# EAGLE design THAT340 (EAGLE 8.1.1)
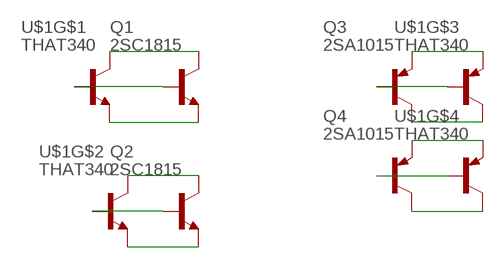
[diagram p0: schematic, sheet 1]

## Parts
Q1  2SC1815  [TO92-BCE]
Q2  2SC1815  [TO92-BCE]
Q3  2SA1015  [TO92-BCE]
Q4  2SA1015  [TO92-BCE]
U$1  THAT340  [DIP254P762X510-14]

## Nets
N$1: Q1.C U$1.1(C)
N$2: Q1.B U$1.2(B)
N$3: Q1.E U$1.3(E)
N$4: Q2.C U$1.14(C)
N$5: Q2.B U$1.13(B)
N$6: Q2.E U$1.12(E)
N$7: Q4.E U$1.10(E)
N$8: Q3.C U$1.7(C)
N$9: Q3.B U$1.6(B)
N$10: Q3.E U$1.5(E)
N$11: Q4.B U$1.9(B)
N$12: Q4.C U$1.8(C)

## Library data of the parts
Q1 Q2 = tranzistory NPN:2SC1815: NPN Transistor
Q3 Q4 = tranzistory PNP:2SA1015: PNP Transistor
U$1 = transistor-arrays:THAT340

## Board
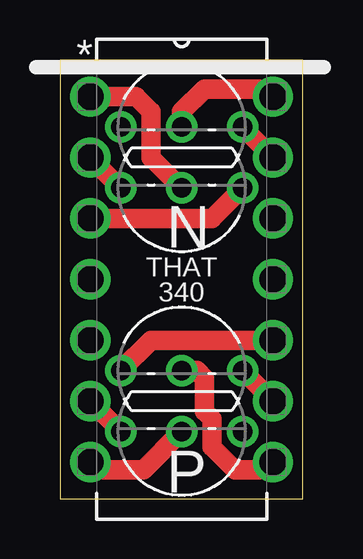
[diagram p1: board, top side]
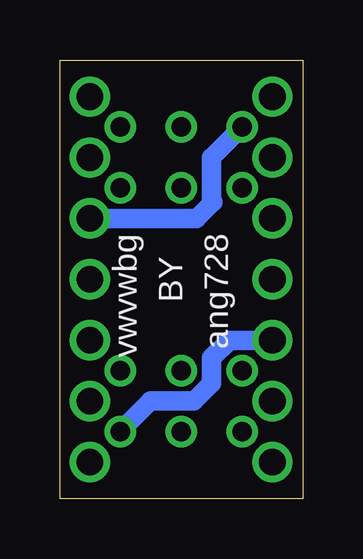
[diagram p2: board, bottom side, seen from below]

Size 10.14 x 18.31 mm. Coordinates in mm from the lower left corner, seen from the top.
Outline: 0,0 10.14,0 10.14,18.31 0,18.31 0,0
Copper layers (1*16): Top 0.035mm / dielectric 1.5mm / Bottom 0.035mm
Design rules "default *": minimum track width 10mil, minimum drill 24mil, track to track 8mil, track to pad 8mil, pad to pad 8mil, via to via 8mil, smd to smd 8mil, copper to edge 8mil, drill to drill 8mil, minimum pad ring 10mil, minimum via ring 8mil, stop-mask expansion 4mil, vias tented up to drill 0mil, thermal gap 10mil

### Footprints (pad centres in the part's own frame; a part is rotated, then mirrored left to right if it is on the bottom)
TO92-BCE = drill 0.813: B 2.54,0; C 0,0; E -2.54,0
DIP254P762X510-14 = drill 1.118: 1 -7.62,15.24; 2 -7.62,12.7; 3 -7.62,10.16; 4 -7.62,7.62; 5 -7.62,5.08; 6 -7.62,2.54; 7 -7.62,0; 8 0,0; 9 0,2.54; 10 0,5.08; 11 0,7.62; 12 0,10.16; 13 0,12.7; 14 0,15.24

### Placement (x,y rotation side)
Q1  5.08,12.97 180 top
Q2  5.08,15.51 0 top
Q3  5.08,2.81 180 top
Q4  5.08,5.35 0 top
U$1  8.89,1.54 0 top

### Tracks (layer width: path | path; a pad name or v marks a point on that pad's centre or on a via)
N$1
  Top 0.813: U$1.1 3.17,16.78 3.81,16.14 3.81,14.24 Q1.C
N$2
  Top 0.813: U$1.2 Q1.B
N$3
  Top 0.813: U$1.3 6.35,11.7 Q1.E
N$4
  Top 0.813: Q2.C 5.08,16.14 6.03,17.1 8.57,17.1 U$1.14
N$5
  Top 0.813: Q2.B U$1.13
N$6
  Bottom 0.813: U$1.12 4.45,11.7 3.76,12.39 3.81,12.44 3.81,14.24 Q2.E
N$7
  Top 0.813: U$1.10 3.81,6.62 Q4.E
N$8
  Top 0.813: Q3.C 3.49,1.22 1.59,1.22 U$1.7
N$9
  Top 0.813: Q3.B U$1.6
N$10
  Bottom 0.813: U$1.5 3.07,6.62 3.81,5.88 3.81,4.82 4.55,4.08 6.35,4.08 Q3.E
N$11
  Top 0.813: Q4.B U$1.9
N$12
  Top 0.813: Q4.C 5.71,5.35 6.03,5.03 6.03,3.65 6.35,3.34 6.35,2.17 7.3,1.22 8.57,1.22 U$1.8

### Text on the board
tPlace: N | THAT / 340 | P
bPlace: ang728 | vwvwbg | BY